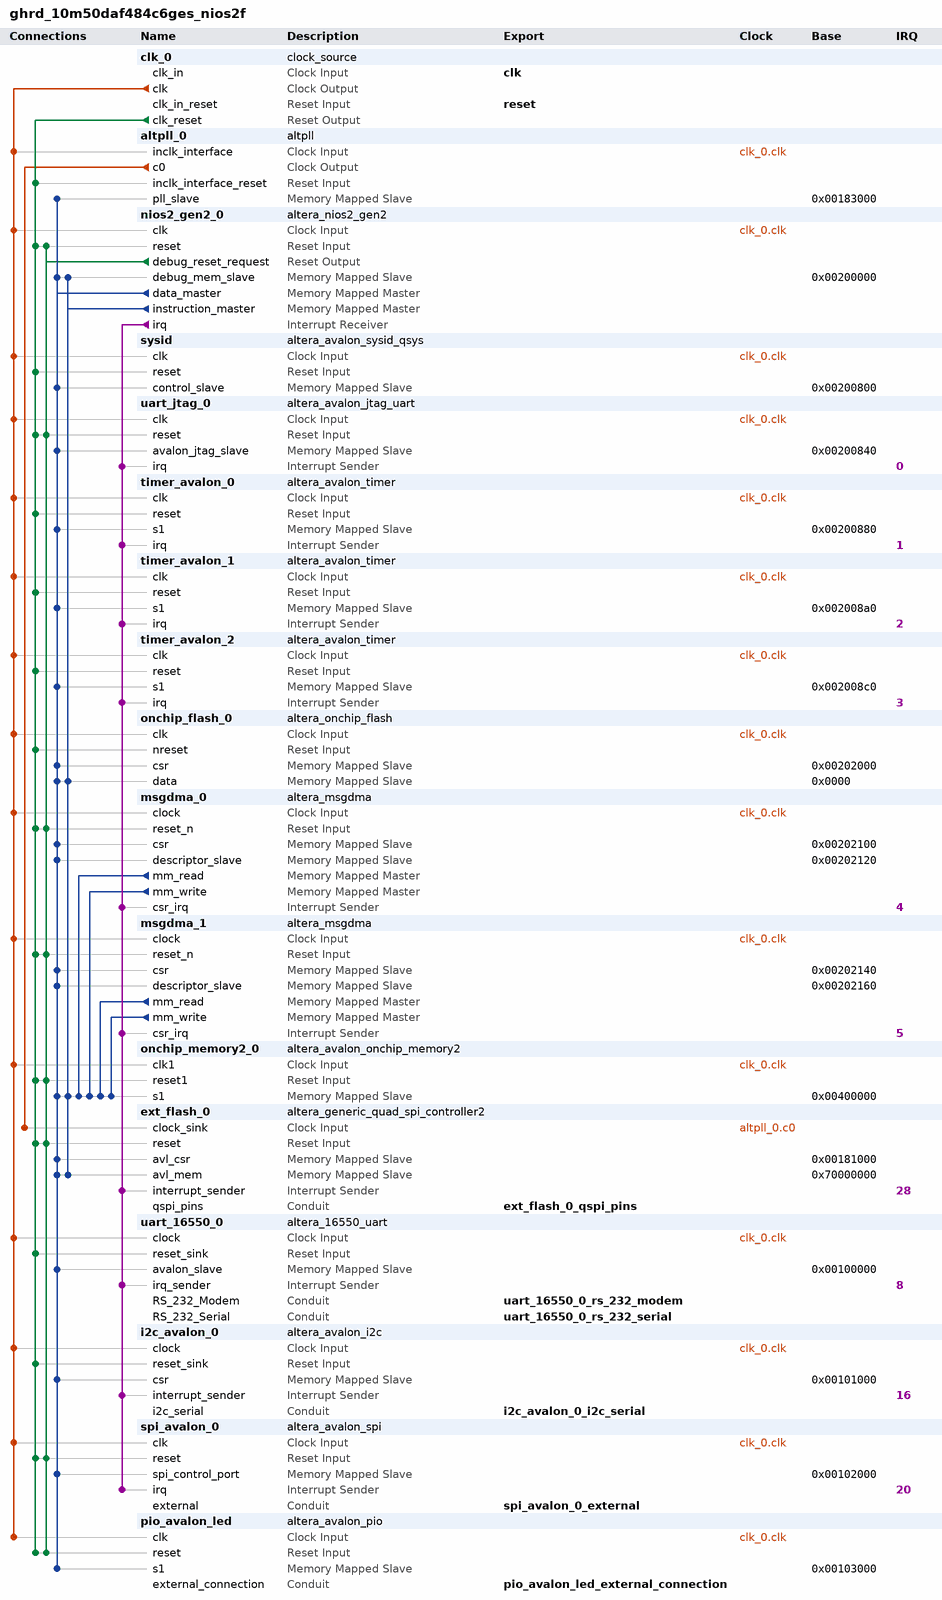
[diagram p0: system contents]
# Platform Designer (Qsys) system ghrd_10m50daf484c6ges_nios2f, MAX 10 10M50DAF484C6GES
# Parameters at their usual value, and those the tool derives, are not listed.
package require -exact qsys 18.1
create_system ghrd_10m50daf484c6ges_nios2f
set_project_property DEVICE_FAMILY {MAX 10}
set_project_property DEVICE 10M50DAF484C6GES

add_instance clk_0 clock_source 18.1
set_instance_parameter_value clk_0 clockFrequency 50000000

add_instance altpll_0 altpll 18.1
set_instance_parameter_value altpll_0 CLK0_DIVIDE_BY 2
set_instance_parameter_value altpll_0 CLK0_MULTIPLY_BY 1
set_instance_parameter_value altpll_0 INCLK0_INPUT_FREQUENCY 20000
set_instance_parameter_value altpll_0 PORT_ARESET PORT_UNUSED
set_instance_parameter_value altpll_0 PORT_LOCKED PORT_UNUSED
set_instance_parameter_value altpll_0 PORT_clk1 PORT_UNUSED
set_instance_parameter_value altpll_0 PORT_clk2 PORT_UNUSED
set_instance_parameter_value altpll_0 PORT_clk3 PORT_UNUSED

add_instance nios2_gen2_0 altera_nios2_gen2 18.1
set_instance_parameter_value nios2_gen2_0 dcache_size 2048
set_instance_parameter_value nios2_gen2_0 debug_datatrigger 4
set_instance_parameter_value nios2_gen2_0 debug_hwbreakpoint 4
set_instance_parameter_value nios2_gen2_0 dividerType srt2
set_instance_parameter_value nios2_gen2_0 exceptionSlave onchip_memory2_0.s1
set_instance_parameter_value nios2_gen2_0 icache_size 4096
set_instance_parameter_value nios2_gen2_0 impl Fast
set_instance_parameter_value nios2_gen2_0 mul_64_impl 1
set_instance_parameter_value nios2_gen2_0 resetSlave onchip_flash_0.data

add_instance sysid altera_avalon_sysid_qsys 18.1
set_instance_parameter_value sysid id 0

add_instance uart_jtag_0 altera_avalon_jtag_uart 18.1
set_instance_parameter_value uart_jtag_0 simInteractiveOptions NO_INTERACTIVE_WINDOWS
set_instance_parameter_value uart_jtag_0 useRegistersForReadBuffer true
set_instance_parameter_value uart_jtag_0 useRegistersForWriteBuffer true

add_instance timer_avalon_0 altera_avalon_timer 18.1
set_instance_parameter_value timer_avalon_0 period 1
set_instance_parameter_value timer_avalon_0 periodUnits MSEC

add_instance timer_avalon_1 altera_avalon_timer 18.1
set_instance_parameter_value timer_avalon_1 period 1
set_instance_parameter_value timer_avalon_1 periodUnits MSEC

add_instance timer_avalon_2 altera_avalon_timer 18.1
set_instance_parameter_value timer_avalon_2 period 1
set_instance_parameter_value timer_avalon_2 periodUnits MSEC

add_instance onchip_flash_0 altera_onchip_flash 18.1
set_instance_parameter_value onchip_flash_0 CONFIGURATION_MODE {Single Compressed Image}
set_instance_parameter_value onchip_flash_0 SECTOR_ACCESS_MODE {Read and write,Read and write,Read and write,Read and write,Hidden}
set_instance_parameter_value onchip_flash_0 initFlashContent false
set_instance_parameter_value onchip_flash_0 initializationFileName altera_onchip_flash.hex
set_instance_parameter_value onchip_flash_0 useNonDefaultInitFile false

add_instance msgdma_0 altera_msgdma 18.1
set_instance_parameter_value msgdma_0 BURST_ENABLE 1
set_instance_parameter_value msgdma_0 BURST_WRAPPING_SUPPORT 1
set_instance_parameter_value msgdma_0 DATA_FIFO_DEPTH 32
set_instance_parameter_value msgdma_0 DATA_WIDTH 32
set_instance_parameter_value msgdma_0 DESCRIPTOR_FIFO_DEPTH 128
set_instance_parameter_value msgdma_0 ENHANCED_FEATURES 0
set_instance_parameter_value msgdma_0 ERROR_ENABLE 0
set_instance_parameter_value msgdma_0 MAX_BURST_COUNT 2
set_instance_parameter_value msgdma_0 MAX_BYTE 1024
set_instance_parameter_value msgdma_0 MODE 0
set_instance_parameter_value msgdma_0 PACKET_ENABLE 0
set_instance_parameter_value msgdma_0 TRANSFER_TYPE {Aligned Accesses}

add_instance msgdma_1 altera_msgdma 18.1
set_instance_parameter_value msgdma_1 BURST_ENABLE 1
set_instance_parameter_value msgdma_1 BURST_WRAPPING_SUPPORT 1
set_instance_parameter_value msgdma_1 DATA_FIFO_DEPTH 32
set_instance_parameter_value msgdma_1 DATA_WIDTH 32
set_instance_parameter_value msgdma_1 DESCRIPTOR_FIFO_DEPTH 128
set_instance_parameter_value msgdma_1 ENHANCED_FEATURES 0
set_instance_parameter_value msgdma_1 ERROR_ENABLE 0
set_instance_parameter_value msgdma_1 MAX_BURST_COUNT 2
set_instance_parameter_value msgdma_1 MAX_BYTE 8192
set_instance_parameter_value msgdma_1 MODE 0
set_instance_parameter_value msgdma_1 PACKET_ENABLE 0
set_instance_parameter_value msgdma_1 TRANSFER_TYPE {Aligned Accesses}

add_instance onchip_memory2_0 altera_avalon_onchip_memory2 18.1
set_instance_parameter_value onchip_memory2_0 dataWidth 32
set_instance_parameter_value onchip_memory2_0 dualPort false
set_instance_parameter_value onchip_memory2_0 initMemContent false
set_instance_parameter_value onchip_memory2_0 initializationFileName onchip_mem.hex
set_instance_parameter_value onchip_memory2_0 memorySize 131072

add_instance ext_flash_0 altera_generic_quad_spi_controller2 18.1
set_instance_parameter_value ext_flash_0 CHIP_SELS 1
set_instance_parameter_value ext_flash_0 DDASI 1
set_instance_parameter_value ext_flash_0 FLASH_TYPE Micron512
set_instance_parameter_value ext_flash_0 GUI_USE_GPIO true
set_instance_parameter_value ext_flash_0 IO_MODE QUAD
set_instance_parameter_value ext_flash_0 clkFreq 25000000

add_instance uart_16550_0 altera_16550_uart 18.1
set_instance_parameter_value uart_16550_0 DMA_EXTRA 0
set_instance_parameter_value uart_16550_0 FAMILY {MAX 10}
set_instance_parameter_value uart_16550_0 FIFO_DEPTH 64
set_instance_parameter_value uart_16550_0 FIFO_HWFC 0
set_instance_parameter_value uart_16550_0 FIFO_MODE 1
set_instance_parameter_value uart_16550_0 FIFO_SWFC 0
set_instance_parameter_value uart_16550_0 FIFO_WATERMARK 0
set_instance_parameter_value uart_16550_0 MEM_BLOCK_TYPE AUTO

add_instance i2c_avalon_0 altera_avalon_i2c 18.1
set_instance_parameter_value i2c_avalon_0 FIFO_DEPTH 16

add_instance spi_avalon_0 altera_avalon_spi 18.1
set_instance_parameter_value spi_avalon_0 clockPhase 1
set_instance_parameter_value spi_avalon_0 clockPolarity 0
set_instance_parameter_value spi_avalon_0 dataWidth 8
set_instance_parameter_value spi_avalon_0 masterSPI true
set_instance_parameter_value spi_avalon_0 numberOfSlaves 1
set_instance_parameter_value spi_avalon_0 targetClockRate 128000

add_instance pio_avalon_led altera_avalon_pio 18.1
set_instance_parameter_value pio_avalon_led direction Output
set_instance_parameter_value pio_avalon_led width 4

# connections
add_connection altpll_0.c0 ext_flash_0.clock_sink clock
add_connection clk_0.clk altpll_0.inclk_interface clock
add_connection clk_0.clk i2c_avalon_0.clock clock
add_connection clk_0.clk msgdma_0.clock clock
add_connection clk_0.clk msgdma_1.clock clock
add_connection clk_0.clk nios2_gen2_0.clk clock
add_connection clk_0.clk onchip_flash_0.clk clock
add_connection clk_0.clk onchip_memory2_0.clk1 clock
add_connection clk_0.clk pio_avalon_led.clk clock
add_connection clk_0.clk spi_avalon_0.clk clock
add_connection clk_0.clk sysid.clk clock
add_connection clk_0.clk timer_avalon_0.clk clock
add_connection clk_0.clk timer_avalon_1.clk clock
add_connection clk_0.clk timer_avalon_2.clk clock
add_connection clk_0.clk uart_16550_0.clock clock
add_connection clk_0.clk uart_jtag_0.clk clock
add_connection clk_0.clk_reset altpll_0.inclk_interface_reset reset
add_connection clk_0.clk_reset ext_flash_0.reset reset
add_connection clk_0.clk_reset i2c_avalon_0.reset_sink reset
add_connection clk_0.clk_reset msgdma_0.reset_n reset
add_connection clk_0.clk_reset msgdma_1.reset_n reset
add_connection clk_0.clk_reset nios2_gen2_0.reset reset
add_connection clk_0.clk_reset onchip_flash_0.nreset reset
add_connection clk_0.clk_reset onchip_memory2_0.reset1 reset
add_connection clk_0.clk_reset pio_avalon_led.reset reset
add_connection clk_0.clk_reset spi_avalon_0.reset reset
add_connection clk_0.clk_reset sysid.reset reset
add_connection clk_0.clk_reset timer_avalon_0.reset reset
add_connection clk_0.clk_reset timer_avalon_1.reset reset
add_connection clk_0.clk_reset timer_avalon_2.reset reset
add_connection clk_0.clk_reset uart_16550_0.reset_sink reset
add_connection clk_0.clk_reset uart_jtag_0.reset reset
add_connection nios2_gen2_0.debug_reset_request ext_flash_0.reset reset
add_connection nios2_gen2_0.debug_reset_request msgdma_0.reset_n reset
add_connection nios2_gen2_0.debug_reset_request msgdma_1.reset_n reset
add_connection nios2_gen2_0.debug_reset_request nios2_gen2_0.reset reset
add_connection nios2_gen2_0.debug_reset_request onchip_memory2_0.reset1 reset
add_connection nios2_gen2_0.debug_reset_request pio_avalon_led.reset reset
add_connection nios2_gen2_0.debug_reset_request spi_avalon_0.reset reset
add_connection nios2_gen2_0.debug_reset_request uart_jtag_0.reset reset
add_connection msgdma_0.mm_read onchip_memory2_0.s1 avalon
set_connection_parameter_value msgdma_0.mm_read/onchip_memory2_0.s1 baseAddress 0x00400000
add_connection msgdma_0.mm_write onchip_memory2_0.s1 avalon
set_connection_parameter_value msgdma_0.mm_write/onchip_memory2_0.s1 baseAddress 0x00400000
add_connection msgdma_1.mm_read onchip_memory2_0.s1 avalon
set_connection_parameter_value msgdma_1.mm_read/onchip_memory2_0.s1 baseAddress 0x00400000
add_connection msgdma_1.mm_write onchip_memory2_0.s1 avalon
set_connection_parameter_value msgdma_1.mm_write/onchip_memory2_0.s1 baseAddress 0x00400000
add_connection nios2_gen2_0.data_master altpll_0.pll_slave avalon
set_connection_parameter_value nios2_gen2_0.data_master/altpll_0.pll_slave baseAddress 0x00183000
add_connection nios2_gen2_0.data_master ext_flash_0.avl_csr avalon
set_connection_parameter_value nios2_gen2_0.data_master/ext_flash_0.avl_csr baseAddress 0x00181000
add_connection nios2_gen2_0.data_master ext_flash_0.avl_mem avalon
set_connection_parameter_value nios2_gen2_0.data_master/ext_flash_0.avl_mem baseAddress 0x70000000
add_connection nios2_gen2_0.data_master i2c_avalon_0.csr avalon
set_connection_parameter_value nios2_gen2_0.data_master/i2c_avalon_0.csr baseAddress 0x00101000
add_connection nios2_gen2_0.data_master msgdma_0.csr avalon
set_connection_parameter_value nios2_gen2_0.data_master/msgdma_0.csr baseAddress 0x00202100
add_connection nios2_gen2_0.data_master msgdma_0.descriptor_slave avalon
set_connection_parameter_value nios2_gen2_0.data_master/msgdma_0.descriptor_slave baseAddress 0x00202120
add_connection nios2_gen2_0.data_master msgdma_1.csr avalon
set_connection_parameter_value nios2_gen2_0.data_master/msgdma_1.csr baseAddress 0x00202140
add_connection nios2_gen2_0.data_master msgdma_1.descriptor_slave avalon
set_connection_parameter_value nios2_gen2_0.data_master/msgdma_1.descriptor_slave baseAddress 0x00202160
add_connection nios2_gen2_0.data_master nios2_gen2_0.debug_mem_slave avalon
set_connection_parameter_value nios2_gen2_0.data_master/nios2_gen2_0.debug_mem_slave baseAddress 0x00200000
add_connection nios2_gen2_0.data_master onchip_flash_0.csr avalon
set_connection_parameter_value nios2_gen2_0.data_master/onchip_flash_0.csr baseAddress 0x00202000
add_connection nios2_gen2_0.data_master onchip_flash_0.data avalon
set_connection_parameter_value nios2_gen2_0.data_master/onchip_flash_0.data baseAddress 0x0000
add_connection nios2_gen2_0.data_master onchip_memory2_0.s1 avalon
set_connection_parameter_value nios2_gen2_0.data_master/onchip_memory2_0.s1 baseAddress 0x00400000
add_connection nios2_gen2_0.data_master pio_avalon_led.s1 avalon
set_connection_parameter_value nios2_gen2_0.data_master/pio_avalon_led.s1 baseAddress 0x00103000
add_connection nios2_gen2_0.data_master spi_avalon_0.spi_control_port avalon
set_connection_parameter_value nios2_gen2_0.data_master/spi_avalon_0.spi_control_port baseAddress 0x00102000
add_connection nios2_gen2_0.data_master sysid.control_slave avalon
set_connection_parameter_value nios2_gen2_0.data_master/sysid.control_slave baseAddress 0x00200800
add_connection nios2_gen2_0.data_master timer_avalon_0.s1 avalon
set_connection_parameter_value nios2_gen2_0.data_master/timer_avalon_0.s1 baseAddress 0x00200880
add_connection nios2_gen2_0.data_master timer_avalon_1.s1 avalon
set_connection_parameter_value nios2_gen2_0.data_master/timer_avalon_1.s1 baseAddress 0x002008a0
add_connection nios2_gen2_0.data_master timer_avalon_2.s1 avalon
set_connection_parameter_value nios2_gen2_0.data_master/timer_avalon_2.s1 baseAddress 0x002008c0
add_connection nios2_gen2_0.data_master uart_16550_0.avalon_slave avalon
set_connection_parameter_value nios2_gen2_0.data_master/uart_16550_0.avalon_slave baseAddress 0x00100000
add_connection nios2_gen2_0.data_master uart_jtag_0.avalon_jtag_slave avalon
set_connection_parameter_value nios2_gen2_0.data_master/uart_jtag_0.avalon_jtag_slave baseAddress 0x00200840
add_connection nios2_gen2_0.instruction_master ext_flash_0.avl_mem avalon
set_connection_parameter_value nios2_gen2_0.instruction_master/ext_flash_0.avl_mem baseAddress 0x70000000
add_connection nios2_gen2_0.instruction_master nios2_gen2_0.debug_mem_slave avalon
set_connection_parameter_value nios2_gen2_0.instruction_master/nios2_gen2_0.debug_mem_slave baseAddress 0x00200000
add_connection nios2_gen2_0.instruction_master onchip_flash_0.data avalon
set_connection_parameter_value nios2_gen2_0.instruction_master/onchip_flash_0.data baseAddress 0x0000
add_connection nios2_gen2_0.instruction_master onchip_memory2_0.s1 avalon
set_connection_parameter_value nios2_gen2_0.instruction_master/onchip_memory2_0.s1 baseAddress 0x00400000
add_connection nios2_gen2_0.irq ext_flash_0.interrupt_sender interrupt
set_connection_parameter_value nios2_gen2_0.irq/ext_flash_0.interrupt_sender irqNumber 28
add_connection nios2_gen2_0.irq i2c_avalon_0.interrupt_sender interrupt
set_connection_parameter_value nios2_gen2_0.irq/i2c_avalon_0.interrupt_sender irqNumber 16
add_connection nios2_gen2_0.irq msgdma_0.csr_irq interrupt
set_connection_parameter_value nios2_gen2_0.irq/msgdma_0.csr_irq irqNumber 4
add_connection nios2_gen2_0.irq msgdma_1.csr_irq interrupt
set_connection_parameter_value nios2_gen2_0.irq/msgdma_1.csr_irq irqNumber 5
add_connection nios2_gen2_0.irq spi_avalon_0.irq interrupt
set_connection_parameter_value nios2_gen2_0.irq/spi_avalon_0.irq irqNumber 20
add_connection nios2_gen2_0.irq timer_avalon_0.irq interrupt
set_connection_parameter_value nios2_gen2_0.irq/timer_avalon_0.irq irqNumber 1
add_connection nios2_gen2_0.irq timer_avalon_1.irq interrupt
set_connection_parameter_value nios2_gen2_0.irq/timer_avalon_1.irq irqNumber 2
add_connection nios2_gen2_0.irq timer_avalon_2.irq interrupt
set_connection_parameter_value nios2_gen2_0.irq/timer_avalon_2.irq irqNumber 3
add_connection nios2_gen2_0.irq uart_16550_0.irq_sender interrupt
set_connection_parameter_value nios2_gen2_0.irq/uart_16550_0.irq_sender irqNumber 8
add_connection nios2_gen2_0.irq uart_jtag_0.irq interrupt
set_connection_parameter_value nios2_gen2_0.irq/uart_jtag_0.irq irqNumber 0

# exported interfaces
add_interface clk clock sink
set_interface_property clk EXPORT_OF clk_0.clk_in
add_interface ext_flash_0_qspi_pins conduit end
set_interface_property ext_flash_0_qspi_pins EXPORT_OF ext_flash_0.qspi_pins
add_interface i2c_avalon_0_i2c_serial conduit end
set_interface_property i2c_avalon_0_i2c_serial EXPORT_OF i2c_avalon_0.i2c_serial
add_interface pio_avalon_led_external_connection conduit end
set_interface_property pio_avalon_led_external_connection EXPORT_OF pio_avalon_led.external_connection
add_interface reset reset sink
set_interface_property reset EXPORT_OF clk_0.clk_in_reset
add_interface spi_avalon_0_external conduit end
set_interface_property spi_avalon_0_external EXPORT_OF spi_avalon_0.external
add_interface uart_16550_0_rs_232_modem conduit end
set_interface_property uart_16550_0_rs_232_modem EXPORT_OF uart_16550_0.RS_232_Modem
add_interface uart_16550_0_rs_232_serial conduit end
set_interface_property uart_16550_0_rs_232_serial EXPORT_OF uart_16550_0.RS_232_Serial

set_interconnect_requirement {$system} qsys_mm.clockCrossingAdapter HANDSHAKE
set_interconnect_requirement {$system} qsys_mm.enableEccProtection FALSE
set_interconnect_requirement {$system} qsys_mm.insertDefaultSlave FALSE
set_interconnect_requirement {$system} qsys_mm.maxAdditionalLatency 1

save_system ghrd_10m50daf484c6ges_nios2f.qsys
